# Altium schematic sheet POWER.SchDoc: Power Supply
size 420 x 297 mm; SheetNumber: 2
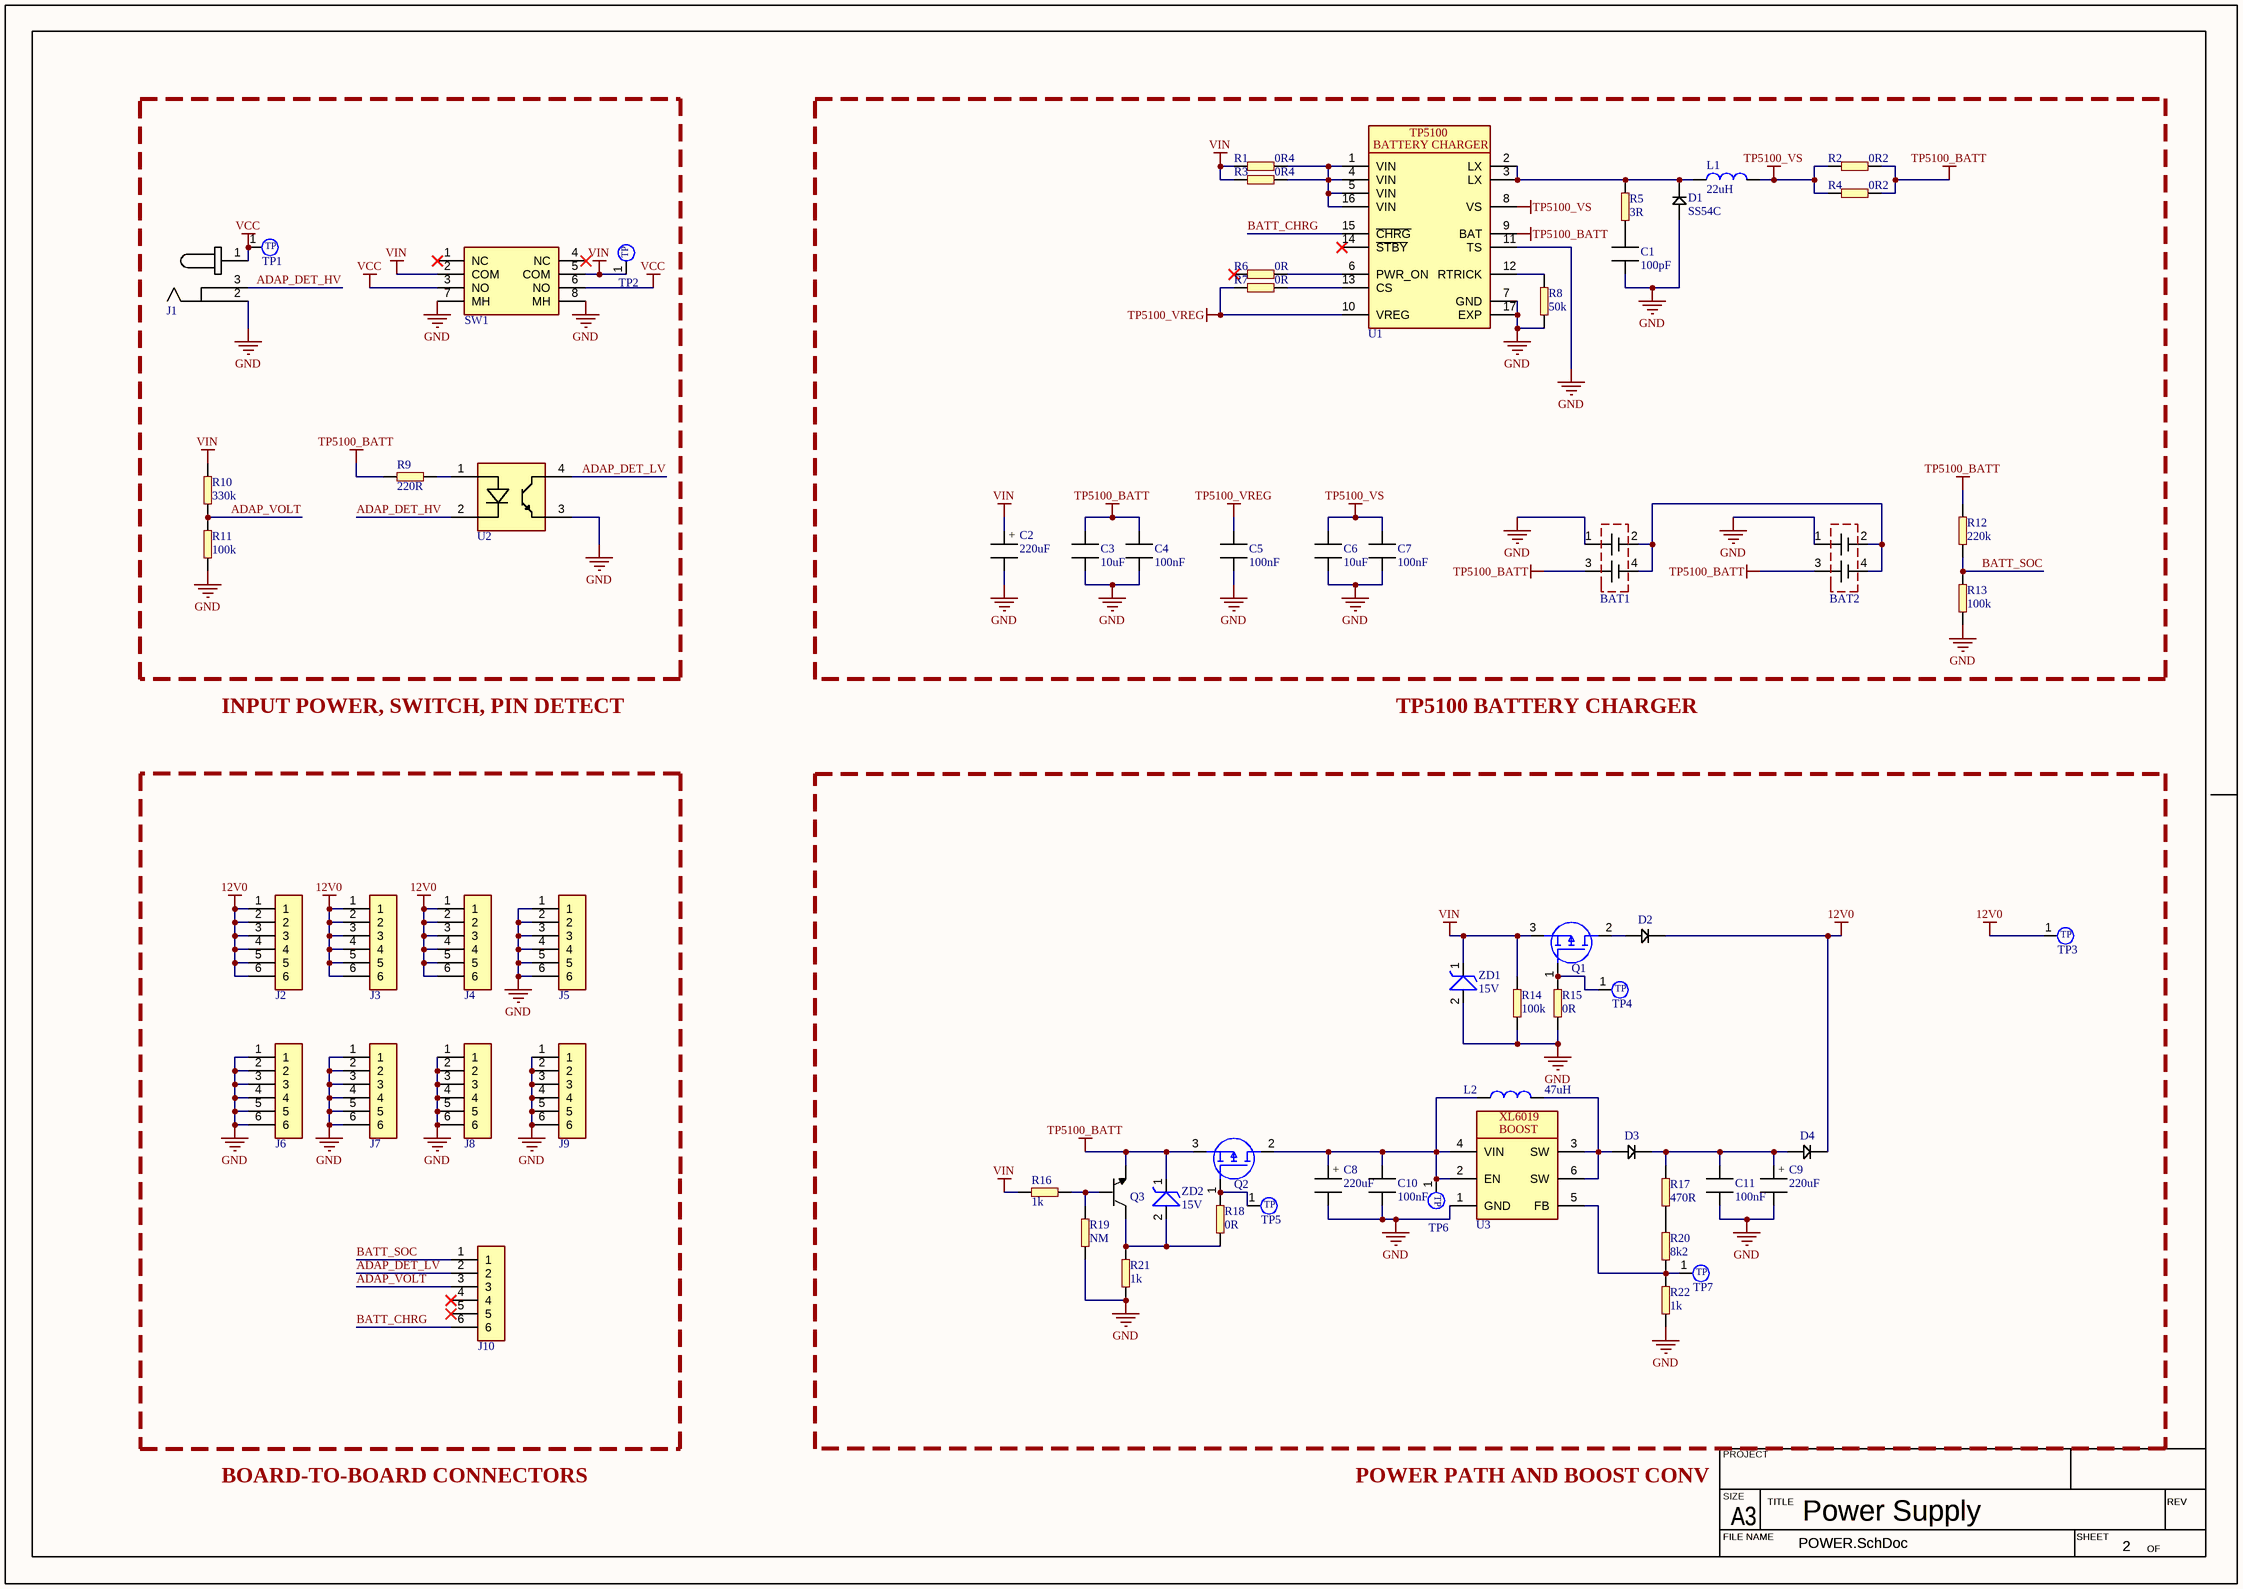
[diagram p0: POWER.SchDoc]

## Parts
BAT1  BK-18650-PC4  [BK-18650-PC4]  (value not drawn)
BAT2  BK-18650-PC4  [BK-18650-PC4]  (value not drawn)
C1  value 100pF  [CAPC2012X13L]  (hidden comment: MLCC_0805)
C2  value 220uF  [CAP_6.3_7.7]  (hidden comment: ERP_102-2)
C3  value 10uF  [CAPC2012X13L]  (hidden comment: MLCC_0805)
C4  value 100nF  [CAPC2012X13L]  (hidden comment: MLCC_0805)
C5  value 100nF  [CAPC2012X13L]  (hidden comment: MLCC_0805)
C6  value 10uF  [CAPC2012X13L]  (hidden comment: MLCC_0805)
C7  value 100nF  [CAPC2012X13L]  (hidden comment: MLCC_0805)
C8  value 220uF  [CAP_6.3_7.7]  (hidden comment: ERP_102-2)
C9  value 220uF  [CAP_6.3_7.7]  (hidden comment: ERP_102-2)
C10  value 100nF  [CAPC2012X13L]  (hidden comment: MLCC_0805)
C11  value 100nF  [CAPC2012X13L]  (hidden comment: MLCC_0805)
D1  value SS54C  [DIOM6959X26L]  (hidden comment: ERP_104-3)
D2  ERP_104-3  [DIOM6959X26L]  (value not drawn)
D3  ERP_104-3  [DIOM6959X26L]  (value not drawn)
D4  ERP_104-3  [DIOM6959X26L]  (value not drawn)
J1  KLDX-0202-AC  [KLDX-0202-AC]  (value not drawn)
J2  ERP_148-2  [6PX1R_F]  (value not drawn)
J3  ERP_148-2  [6PX1R_F]  (value not drawn)
J4  ERP_148-2  [6PX1R_F]  (value not drawn)
J5  ERP_148-2  [6PX1R_F]  (value not drawn)
J6  ERP_148-2  [6PX1R_F]  (value not drawn)
J7  ERP_148-2  [6PX1R_F]  (value not drawn)
J8  ERP_148-2  [6PX1R_F]  (value not drawn)
J9  ERP_148-2  [6PX1R_F]  (value not drawn)
J10  ERP_148-2  [6PX1R_F]  (value not drawn)
L1  value 22uH  [IND_1212]  (hidden comment: IND_1212)
L2  value 47uH  [IND_1212]  (hidden comment: IND_1212)
Q1  IRFR5305TRPBF  [DPAK229P991X239-3M]  (value not drawn)
Q2  IRFR5305TRPBF  [DPAK229P991X239-3M]  (value not drawn)
Q3  ERP_105-1  [MMBT2222]  (value not drawn)
R1  value 0R4  [RESC3116X06M]  (hidden comment: RES_1206)
R2  value 0R2  [RESC3116X06M]  (hidden comment: RES_1206)
R3  value 0R4  [RESC3116X06M]  (hidden comment: RES_1206)
R4  value 0R2  [RESC3116X06M]  (hidden comment: RES_1206)
R5  value 3R  [RES_0603]  (hidden comment: ERP_101-1)
R6  value 0R  [RES_0603]  (hidden comment: ERP_101-1)
R7  value 0R  [RES_0603]  (hidden comment: ERP_101-1)
R8  value 50k  [RES_0603]  (hidden comment: ERP_101-1)
R9  value 220R  [RES_0603]  (hidden comment: ERP_101-1)
R10  value 330k  [RES_0603]  (hidden comment: ERP_101-1)
R11  value 100k  [RES_0603]  (hidden comment: ERP_101-1)
R12  value 220k  [RES_0603]  (hidden comment: ERP_101-1)
R13  value 100k  [RES_0603]  (hidden comment: ERP_101-1)
R14  value 100k  [RES_0603]  (hidden comment: ERP_101-1)
R15  value 0R  [RES_0603]  (hidden comment: ERP_101-1)
R16  value 1k  [RES_0603]  (hidden comment: ERP_101-1)
R17  value 470R  [RES_0603]  (hidden comment: ERP_101-1)
R18  value 0R  [RES_0603]  (hidden comment: ERP_101-1)
R19  value NM  [RES_0603]  (hidden comment: ERP_101-1)  (no BOM)
R20  value 8k2  [RES_0603]  (hidden comment: ERP_101-1)
R21  value 1k  [RES_0603]  (hidden comment: ERP_101-1)
R22  value 1k  [RES_0603]  (hidden comment: ERP_101-1)
SW1  ERP_110-4  [PBH2U]  (value not drawn)
TP1  TP_1MM  [TP_1MM]  (value not drawn)  (no BOM)
TP2  TP_1MM  [TP_1MM]  (value not drawn)  (no BOM)
TP3  TP_1MM  [TP_1MM]  (value not drawn)  (no BOM)
TP4  TP_1MM  [TP_1MM]  (value not drawn)  (no BOM)
TP5  TP_1MM  [TP_1MM]  (value not drawn)  (no BOM)
TP6  TP_1MM  [TP_1MM]  (value not drawn)  (no BOM)
TP7  TP_1MM  [TP_1MM]  (value not drawn)  (no BOM)
U1  TP5100  [QFN65P400X400X90_HS-17M]  (value not drawn)
U2  FOD817A3SD  [FOD817A3SD]  (value not drawn)
U3  XL6019  [DPAK171P1524X483-6M]  (value not drawn)
ZD1  value 15V  [SOD323]  (hidden comment: MM3Z)
ZD2  value 15V  [SOD323]  (hidden comment: MM3Z)

## Nets
12V0: D2.1(C) D4.1(C) J2.1 J2.2 J2.3 J2.4 J2.5 J2.6 J3.1 J3.2 J3.3 J3.4 J3.5 J3.6 J4.1 J4.2 J4.3 J4.4 J4.5 J4.6 TP3.1
GND: BAT1.1(+) BAT2.1(+) C1.2 C2.2 C3.2 C4.2 C5.2 C6.2 C7.2 C8.2 C9.2 C10.2 C11.2 D1.2(A) J1.2 J5.1 J5.2 J5.3 J5.4 J5.5 J5.6 J6.1 J6.2 J6.3 J6.4 J6.5 J6.6 J7.1 J7.2 J7.3 J7.4 J7.5 J7.6 J8.1 J8.2 J8.3 J8.4 J8.5 J8.6 J9.1 J9.2 J9.3 J9.4 J9.5 J9.6 R8.1 R11.2 R13.1 R14.1 R15.1 R19.2 R21.2 R22.2 SW1.7(MH) SW1.8(MH) U1.7(GND) U1.11(TS) U1.17(EXP) U2.3(EMITTER) U3.1(GND) ZD1.2(A)
TP5100_BATT: BAT1.3(+) BAT2.3(+) C3.1 C4.1 Q2.3(S) Q3.2 R2.1 R4.1 R9.1 R12.2 U1.9(BAT) ZD2.1(K)
TP5100_VREG: C5.1 R7.1 U1.10(VREG)
TP5100_VS: C6.1 C7.1 L1.2 R2.2 R4.2 U1.8(VS)
VCC: J1.1 SW1.3(NO) SW1.6(NO) TP1.1
VIN: C2.1 Q1.3(S) R1.2 R3.2 R10.2 R14.2 R16.2 SW1.2(COM) SW1.5(COM) TP2.1 ZD1.1(K)
ADAP_DET_HV: J1.3 U2.2(CATHODE)
ADAP_DET_LV: J10.2 U2.4(COLLECTOR)
ADAP_VOLT: J10.3 R10.1 R11.1
BATT_CHRG: J10.6 U1.15(~{CHRG})
BATT_SOC: J10.1 R12.1 R13.2
NetBAT1_2: BAT1.2(-) BAT1.4(-) BAT2.2(-) BAT2.4(-)
NetC1_1: C1.1 R5.1
NetC8_1: C8.1 C10.1 L2.1 Q2.2(D) TP6.1 U3.2(EN) U3.4(VIN)
NetC9_1: C9.1 C11.1 D3.1(C) D4.2(A) R17.1
NetD1_1: D1.1(C) L1.1 R5.2 U1.2(LX) U1.3(LX)
NetD2_2: D2.2(A) Q1.2(D)
NetD3_2: D3.2(A) L2.2 U3.3(SW) U3.6(SW)
NetQ1_1: Q1.1(G) R15.2 TP4.1
NetQ2_1: Q2.1(G) R18.2 TP5.1
NetQ3_1: Q3.1 R16.1 R19.1
NetQ3_3: Q3.3 R18.1 R21.1 ZD2.2(A)
NetR1_1: R1.1 R3.1 U1.1(VIN) U1.4(VIN) U1.5(VIN) U1.16(VIN)
NetR6_2: R6.2 U1.6(PWR_ON)
NetR7_2: R7.2 U1.13(CS)
NetR8_2: R8.2 U1.12(RTRICK)
NetR9_2: R9.2 U2.1(ANODE)
NetR17_2: R17.2 R20.1
NetR20_2: R20.2 R22.1 TP7.1 U3.5(FB)

Not connected (* = marked no-connect by the designer): J10 4* 5*; R6 1*; SW1 1(NC)* 4(NC)*; U1 14(~{STBY})*

## Notes on the sheet
- INPUT POWER, SWITCH, PIN DETECT
- TP5100 BATTERY CHARGER
- BOARD-TO-BOARD CONNECTORS
- POWER PATH AND BOOST CONV
- PROJECT
- SIZE
- FILE NAME
- A3
- TITLE
- SHEET
- OF
- REV
- (in symbol CAP_6.3_7.7) +
- (in symbol TP5100) BATTERY CHARGER
- (in symbol TP_1MM) TP
- (in symbol XL6019) BOOST

## Library data of the parts
BAT1 BAT2 = BK-18650-PC4: BATT HOLDER 18650 2 CELL PC PIN; Manufacturer 1: MPD; Value: *; Manufacturer Part Number 1: BK-18650-PC4; Supplier 1: *; Supplier Part Number 1: *
C1 C3-C7 C10 C11 = MLCC_0805: Chip Capacitor, 2-Leads, Body 2.00x1.25mm, IPC High Density; Package: 0805; Manufacturer 1: *; Manufacturer Part Number 1: *
C2 C8 C9 = CAP_6.3_7.7: Electrolytic Capacitor SMD 6.3x7.7; ERP: 1; Package: 6.3x7.7; Manufacturer 1: *; Manufacturer Part Number 1: *; Supplier 1: Sharvi; Supplier Part Number 1: *
D1 = SS54: Manufacturer 1: MDD; Supplier Part Number 1: *; Supplier  1: *; Package: SMC; Manufacturer Part Number 1: SS54C
D2-D4 = SS54: Manufacturer Part Number 1: SS54C; Manufacturer 1: MDD; Value: SS54C; Supplier Part Number 1: *; Supplier  1: *; Package: SMC
J1 = KLDX-0202-AC: CONN PWR JACK 2X5.5MM KINKED PIN; Manufacturer 1: Sharvi; Manufacturer Part Number 1: ST2001CO0701; Value: NA
J2-J10 = 6PX1R_F: 6PX1R Female Header; Value: *; Manufacturer 1: *; Manufacturer Part Number 1: *
Q1 Q2 = IRFR5305TRPBF: P Channel MOSFET -55V HEXFET 65mOhms 42nC TO-252-3; Manufacturer 1: International Rectifier; Value: *; Supplier Part Number 1: *; Supplier 1: *; Manufacturer Part Number 1: IRFR5305TRPBF
Q3 = MMBT2222: MMBT2222A; ERP: *; Suuplier Part Number 1: *; Supplier 1: *; Manufacturer Part Number 1: *; Manufacturer 1: *; Package: SOT23; Value: MMBT2222A
R5-R22 = RES_0603: Package: 0603; Manufacturer 1: *; Manufacturer Part Number 1: *
SW1 = PBH2U: Pushbutton Switch DPDT Standard Through Hole, Right Angle; Manufacturer Part Number 1: ST2106CO3161; Manufacturer 1: Sharvi; Package: *; Value: *
U1 = TP5100: Switching-buck type (double 8.4V / single 4.2V) lithium battery charging management chip; Manufacturer 1: Top Power; Value: *; Manufacturer Part Number 1: TP5100; Supplier 1: *; Supplier Part Number 1: *
U2 = FOD817A3SD: OPTOISOLATOR 5KV TRANSISTOR 4SMD; Value: *; Manufacturer: *; Manufacturer Part Number 1: *
U3 = XL6019: 5A 180KHz 32V Boost DC to DC Converter; Manufacturer 1: XLSemi; Value: *; Manufacturer Part Number 1: XL6019; Supplier 1: *; Supplier Part Number 1: *
ZD1 ZD2 = MM3Z: Zener SOD-323 0.3W; Manufacturer 1: *; Manufacturer Part Number 1: *; Supplier 1: *; Supplier Part Number 1: *
L1 L2 = IND_1212: Manufacturer Part Number 1: *; Manufacturer 1: *; Supplier 1: *; Supplier Part Number 1: *
R1-R4 = RES_1206: Package: 1206; Manufacturer 1: *; Manufacturer Part Number 1: *; Supplier Part Number 1: *; Supplier 1: *